# Altium schematic sheet jack driver 1.SchDoc
size A4; SheetNumber: 7; SheetTotal: 9
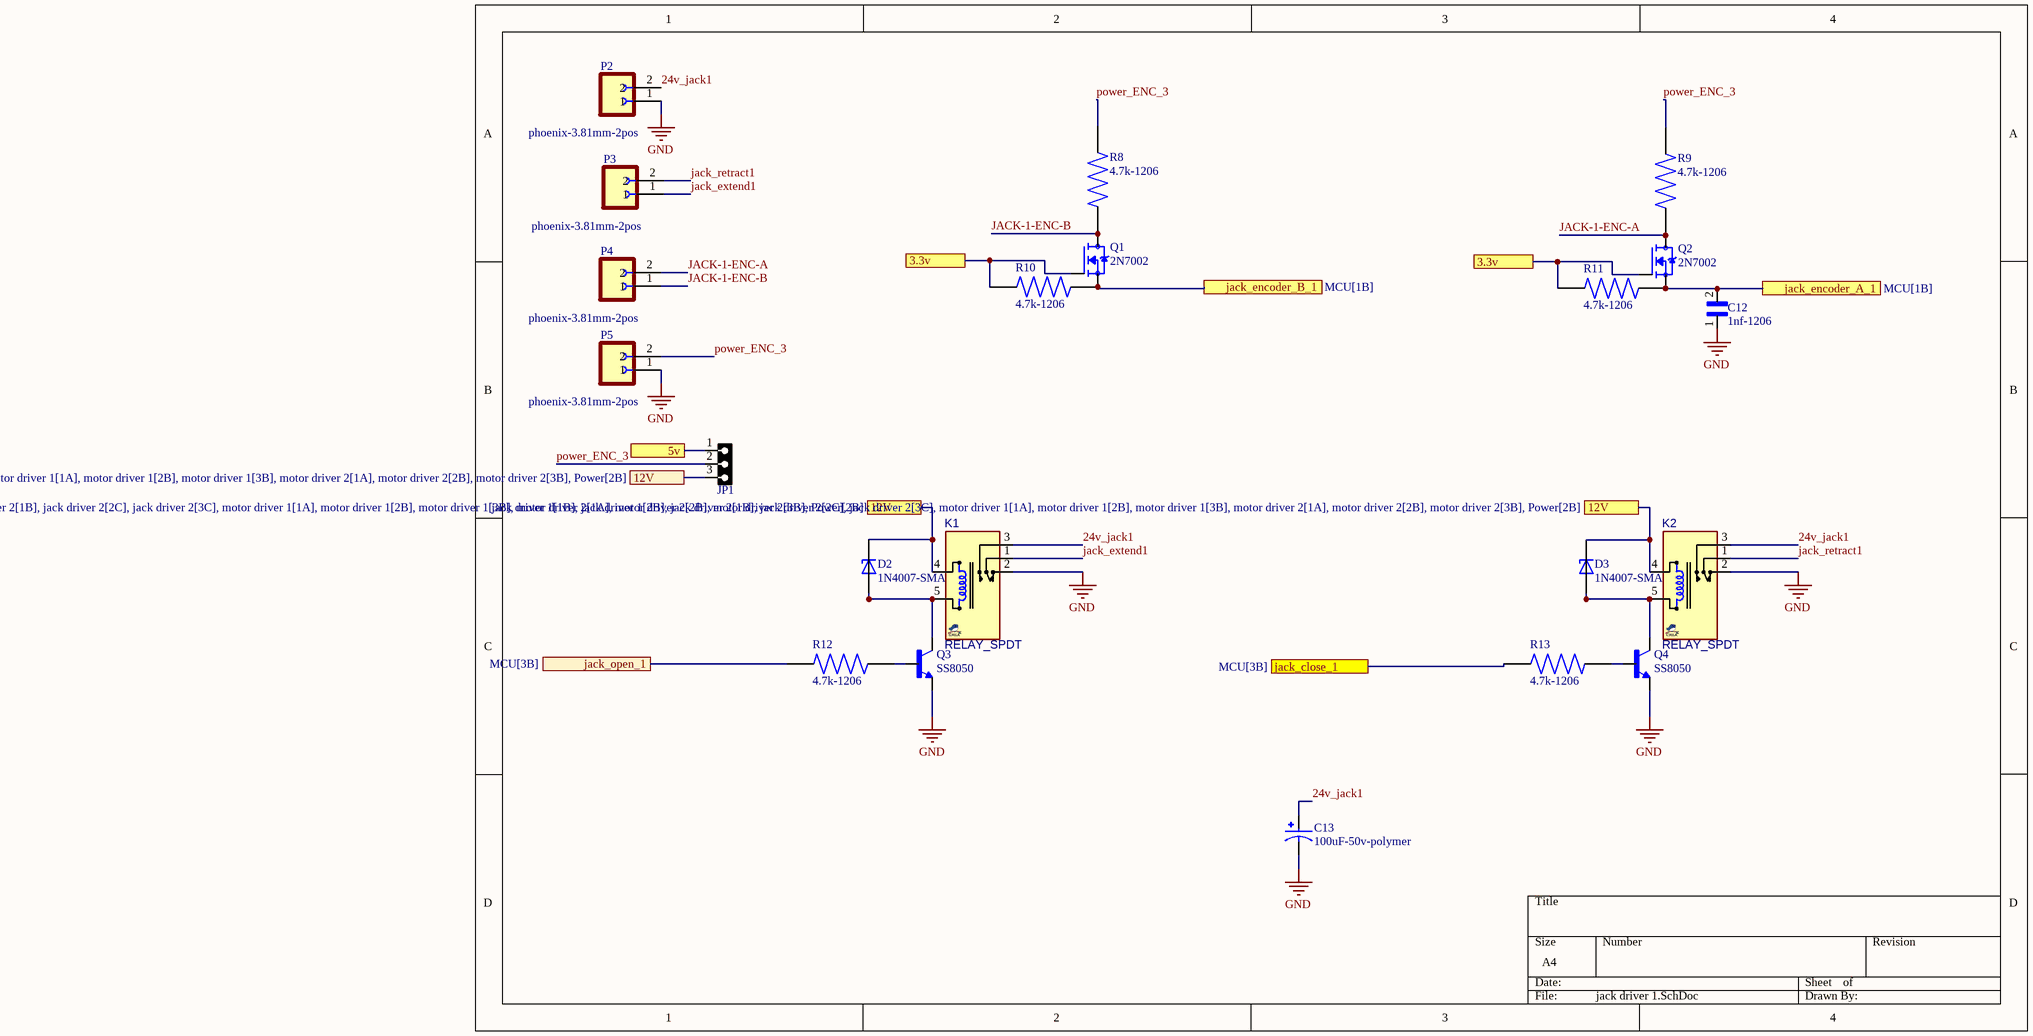
[diagram p0: jack driver 1.SchDoc]

## Parts
C12  1nf-1206  [CAPC3216X180N]
C13  100uF-50v-polymer  [CAP_EEEFN1H101L]
D2  1N4007-SMA  [DIOM4325X250N]
D3  1N4007-SMA  [DIOM4325X250N]
JP1  HDRF3  [HDRLP_F_1X3]  (value not drawn)
K1  RELAY_SPDT  [REL_SPDT_5_1512]
K2  RELAY_SPDT  [REL_SPDT_5_1512]
P2  phoenix-3.81mm-2pos  [PHOENIX_1803578]
P3  phoenix-3.81mm-2pos  [PHOENIX_1803578]
P4  phoenix-3.81mm-2pos  [PHOENIX_1803578]
P5  phoenix-3.81mm-2pos  [PHOENIX_1803578]
Q1  2N7002  [SOT95P240X111-3N]
Q2  2N7002  [SOT95P240X111-3N]
Q3  SS8050  [TRANS_SS8050-G]
Q4  SS8050  [TRANS_SS8050-G]
R8  4.7k-1206  [RESC3015X65N]
R9  4.7k-1206  [RESC3015X65N]
R10  4.7k-1206  [RESC3015X65N]
R11  4.7k-1206  [RESC3015X65N]
R12  4.7k-1206  [RESC3015X65N]
R13  4.7k-1206  [RESC3015X65N]

## Ports
3.3v (see interface[0D], interface[1D], interface[3C], jack driver 1[2A], jack driver 2[2A], jack driver 2[3B], motor driver 1[2B], motor driver 1[3B], motor driver 2[2B], motor driver 2[3B], Power[2D], receiver 1[2A], receiver 1[2C], receiver 1[4A], receiver 1[4C], receiver 2[2A], receiver 2[2C], receiver 2[4A], receiver 2[4C]), 3.3v (see interface[0D], interface[1D], interface[3C], jack driver 1[3B], jack driver 2[2A], jack driver 2[3B], motor driver 1[2B], motor driver 1[3B], motor driver 2[2B], motor driver 2[3B], Power[2D], receiver 1[2A], receiver 1[2C], receiver 1[4A], receiver 1[4C], receiver 2[2A], receiver 2[2C], receiver 2[4A], receiver 2[4C]), 5v (see interface[1A], interface[1B], interface[1C], interface[2A], interface[2B], interface[2C], interface[3A], interface[3B], interface[4A], interface[4B], jack driver 2[1B], MCU[1A], motor driver 1[1A], motor driver 2[1A], Power[2C]), 12V (see jack driver 1[1B], jack driver 1[2B], jack driver 2[1B], jack driver 2[2C], jack driver 2[3C], motor driver 1[1A], motor driver 1[2B], motor driver 1[3B], motor driver 2[1A], motor driver 2[2B], motor driver 2[3B], Power[2B]), 12V (see jack driver 1[1B], jack driver 1[3B], jack driver 2[1B], jack driver 2[2C], jack driver 2[3C], motor driver 1[1A], motor driver 1[2B], motor driver 1[3B], motor driver 2[1A], motor driver 2[2B], motor driver 2[3B], Power[2B]), 12V (see jack driver 1[2B], jack driver 1[3B], jack driver 2[1B], jack driver 2[2C], jack driver 2[3C], motor driver 1[1A], motor driver 1[2B], motor driver 1[3B], motor driver 2[1A], motor driver 2[2B], motor driver 2[3B], Power[2B]), jack_close_1 (see MCU[3B]), jack_encoder_A_1 (see MCU[1B]), jack_encoder_B_1 (see MCU[1B]), jack_open_1 (see MCU[3B])

## Nets
GND: C12.1 C13.2 K1.2(NC) K2.2(NC) P2.1 P5.1 Q3.2(E) Q4.2(E)
3.3v: Q1.1(G) Q2.1(G) R10.2 R11.2 ; port 3.3v
5v: JP1.1 ; port 5v
12V: D2.C D3.C JP1.3 K1.4(T1) K2.4(T1) ; port 12V
24v_jack1: C13.1 K1.3(NO) K2.3(NO) P2.2
JACK-1-ENC-A: P4.2 Q2.3(D) R9.1
JACK-1-ENC-B: P4.1 Q1.3(D) R8.1
jack_close_1: R13.2 ; port jack_close_1
jack_encoder_A_1: C12.2 Q2.2(S) R11.1 ; port jack_encoder_A_1
jack_encoder_B_1: Q1.2(S) R10.1 ; port jack_encoder_B_1
jack_extend1: K1.1(COM) P3.1
jack_open_1: R12.2 ; port jack_open_1
jack_retract1: K2.1(COM) P3.2
power_ENC_3: JP1.2 P5.2 R8.2 R9.2
NetD2_A: D2.A K1.5(T2) Q3.3(C)
NetD3_A: D3.A K2.5(T2) Q4.3(C)
NetQ3_1: Q3.1(B) R12.1
NetQ4_1: Q4.1(B) R13.1

## Library data of the parts
C12 = CGA5L3X8R1H105M160AB: 1ÂµF Â±20% 50V Ceramic Capacitor X8R 1206 (3216 Metric); MF: TDK; Value: *; Purchase-URL: https://pricing.snapeda.com/search/part/CGA5L3X8R1H105M160AB/?ref=eda; Package: 3216 TDK; Availability: In Stock; SnapEDA_Link: https://www.snapeda.com/parts/CGA5L3X8R1H105M160AB/TDK/view-part/?ref=snap; MP: CGA5L3X8R1H105M160AB; Check_prices: https://www.snapeda.com/parts/CGA5L3X8R1H105M160AB/TDK/view-part/?ref=eda; Price: None
C13 = EEEFN1H101L: CAP ALUM 100UF 20% 50V SMD; MF: Panasonic; SnapEDA_Link: https://www.snapeda.com/parts/EEEFN1H101L/Panasonic/view-part/?ref=snap; Package: RADIAL-2 Panasonic; Value: *; MP: EEEFN1H101L; Check_prices: https://www.snapeda.com/parts/EEEFN1H101L/Panasonic/view-part/?ref=eda
D2 D3 = SMAJ26A: 400W, 30.4V, 5%, Unidirectional, TVS; MF: Taiwan Semiconductor; SnapEDA_Link: https://www.snapeda.com/parts/SMAJ26A/taiwan/view-part/?ref=snap; Package: SMA-2 Taiwan Semiconductor; Value: *; MP: SMAJ26A; Check_prices: https://www.snapeda.com/parts/SMAJ26A/taiwan/view-part/?ref=eda
JP1 = HDRLP_F_1X3: CONN, HEADER, Male, pitch: 2.54mm, 3POS; VALUE: HDRF3
K1 K2 = RELAY_SPDT_5_1512_G8QN: Relay, SPDT, 5P, 15.4X12.1mm, 16V/30A; MANF: OMRON; MANF_P#: G8QN-1C4 DC12; PARAM2: 16VDC, 30A; PARAM: 12V, 50mA; PRICE: PRICE; Value: RELAY_SPDT
P2-P5 = 1803578: 2 Position Terminal Block Plug, Female Sockets 0.150 (3.81mm) 180Â° Free Hanging (In-Line); MF: Phoenix Contact; Price: None; Purchase-URL: https://pricing.snapeda.com/search/part/1803578/?ref=eda; Availability: Good; SnapEDA_Link: https://www.snapeda.com/parts/1803578/Phoenix%20Contact/view-part/46882/?ref=snap; MP: 1803578; Value: *; Check_prices: https://www.snapeda.com/parts/1803578/Phoenix%20Contact/view-part/46882/?ref=eda; Package: Custom Package Phoenix Contact
Q1 Q2 = 2N7002: N-Channel 60V 280mA (Ta) 350mW (Ta) Surface Mount SOT-23-3 (TO-236); MF: {'manufacturer': u'onsemi'}; Package: None; Price: None; Value: *; MP: 2N7002; Availability: Unavailable
Q3 Q4 = SS8050-G: Bipolar (BJT) Transistor NPN 25 V 1.5 A 100MHz 300 mW Surface Mount SOT-23-3; MP: SS8050G; MF: Comchip; Digi-Key_Part_Number: 641-1790-2-ND; Check_prices: https://www.snapeda.com/parts/SS8050G/Comchip/view-part/?ref=eda; Package: None; SnapEDA_Link: https://www.snapeda.com/parts/SS8050G/Comchip/view-part/?ref=snap; Value: *
R8-R13 = CPF1206B10KE1: Res Thin Film 1206 10K Ohm 0.1% 1/8W Â±25ppm/Â°C Molded SMD SMD Paper T/R; Power_Rating: .125 W; MF: TE Connectivity; Voltage_Rating: 150 V; Tolerance: .1%; SnapEDA_Link: https://www.snapeda.com/parts/CPF1206B10KE1/TE+Connectivity/view-part/?ref=snap; Package: 1206; Resistance: 10K; Value: *; MP: CPF1206B10KE1; EU_RoHS_Compliance: Compliant; Check_prices: https://www.snapeda.com/parts/CPF1206B10KE1/TE+Connectivity/view-part/?ref=eda